# Altium schematic sheet IO.SchDoc: Digital I/O + ESD
size A4; Date: 23.10.2016; Engineer: Matjaz Tome; DocumentNumber: 8; Revision: B1; SheetNumber: 8; SheetTotal: 8; Project: USB DAQ
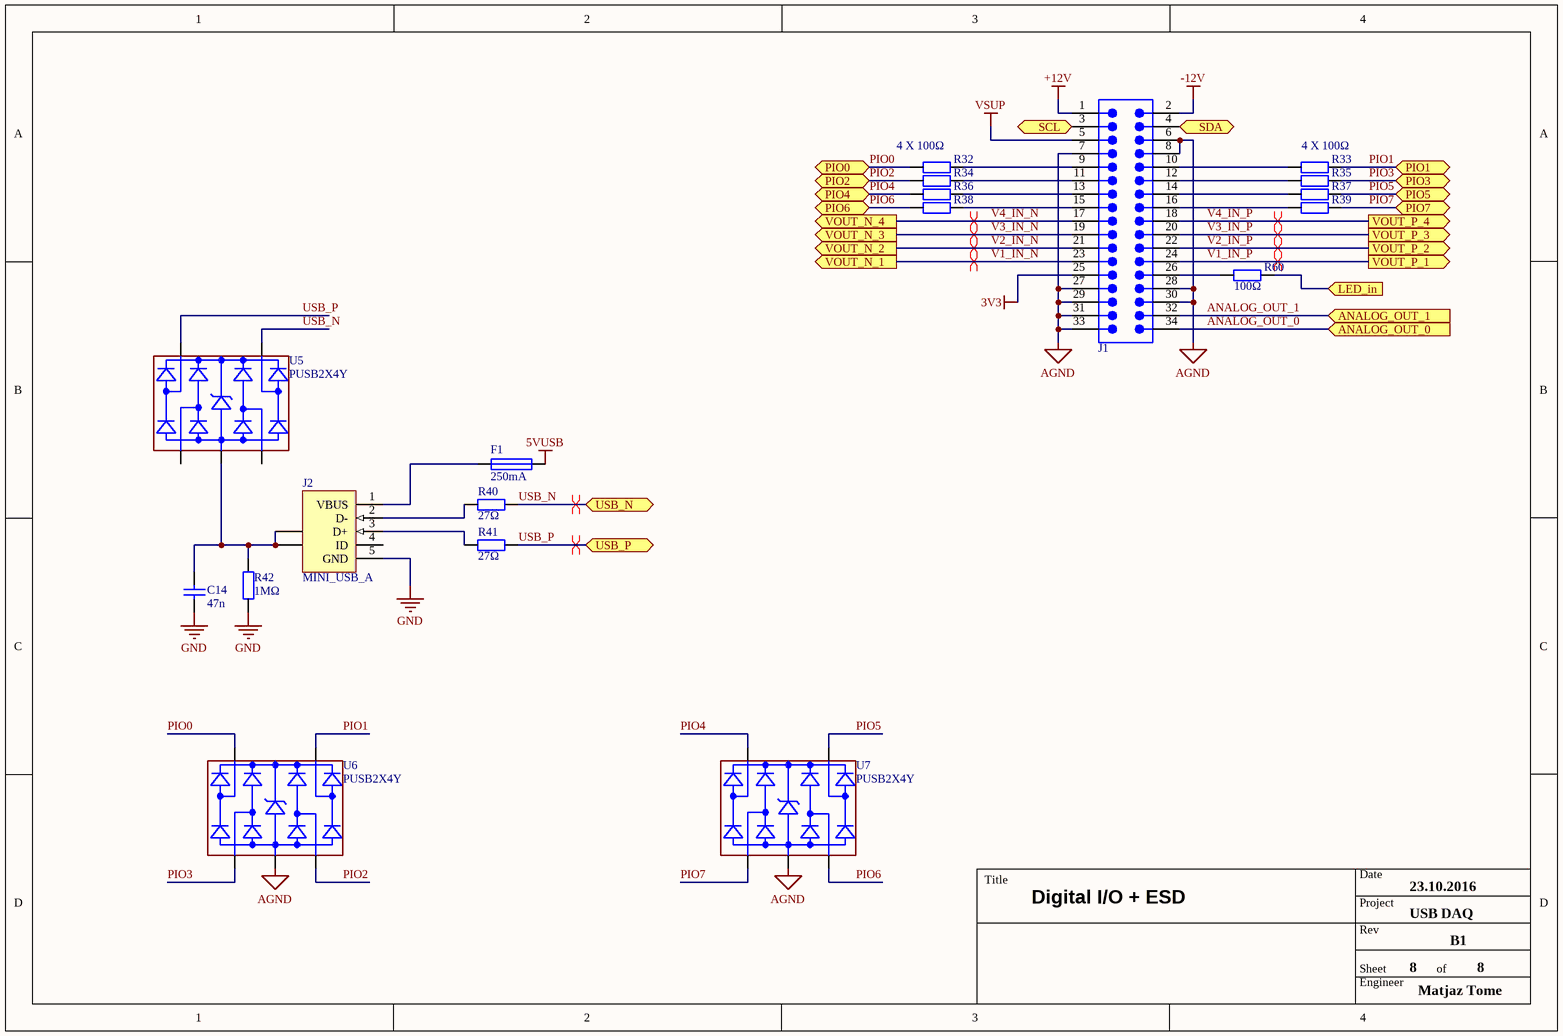
[diagram p0: IO.SchDoc]

## Parts
C14  47n  [0603C]
F1  250mA  [1206]
J1  IDC34R  [IDC34R]  (value not drawn)
J2  MINI_USB_A  [MICRO_USB_A]
R32  100Ω  [0603R]  (value not drawn)
R33  100Ω  [0603R]  (value not drawn)
R34  100Ω  [0603R]  (value not drawn)
R35  100Ω  [0603R]  (value not drawn)
R36  100Ω  [0603R]  (value not drawn)
R37  100Ω  [0603R]  (value not drawn)
R38  100Ω  [0603R]  (value not drawn)
R39  100Ω  [0603R]  (value not drawn)
R40  27Ω  [0603R]
R41  27Ω  [0603R]
R42  1MΩ  [0603R]
R60  100Ω  [0603R]
U5  PUSB2X4Y  [SOT363]
U6  PUSB2X4Y  [SOT363]
U7  PUSB2X4Y  [SOT363]

## Ports
ANALOG_OUT_0 (in), ANALOG_OUT_1 (in), LED_in (in), PIO0 (bidir), PIO1 (bidir), PIO2 (bidir), PIO3 (bidir), PIO4 (bidir), PIO5 (bidir), PIO6 (bidir), PIO7 (bidir), SCL (in), SDA (bidir), USB_N (bidir), USB_P (bidir), VOUT_N_1 (out), VOUT_N_2 (out), VOUT_N_3 (out), VOUT_N_4 (out), VOUT_P_1 (out), VOUT_P_2 (out), VOUT_P_3 (out), VOUT_P_4 (out)

## Nets
3V3: J1.25
5VUSB: F1.2
+12V: J1.1
-12V: J1.2
AGND: J1.6 J1.7 J1.8 J1.27 J1.28 J1.29 J1.30 J1.31 J1.33 U6.2 U7.2
GND: C14.1 J2.5(GND) R42.1
VSUP: J1.5
ANALOG_OUT_0: J1.34 ; port ANALOG_OUT_0
ANALOG_OUT_1: J1.32 ; port ANALOG_OUT_1
LED_in: R60.2 ; port LED_in
PIO0: R32.1 U6.6 ; port PIO0
PIO1: R33.2 U6.4 ; port PIO1
PIO2: R34.1 U6.3 ; port PIO2
PIO3: R35.2 U6.1 ; port PIO3
PIO4: R36.1 U7.6 ; port PIO4
PIO5: R37.2 U7.4 ; port PIO5
PIO6: R38.1 U7.3 ; port PIO6
PIO7: R39.2 U7.1 ; port PIO7
SCL: J1.3 ; port SCL
SDA: J1.4 ; port SDA
USB_N: R40.2 U5.4 ; port USB_N
USB_P: R41.2 U5.6 ; port USB_P
V1_IN_N: J1.23 ; port VOUT_N_1
V1_IN_P: J1.24 ; port VOUT_P_1
V2_IN_N: J1.21 ; port VOUT_N_2
V2_IN_P: J1.22 ; port VOUT_P_2
V3_IN_N: J1.19 ; port VOUT_N_3
V3_IN_P: J1.20 ; port VOUT_P_3
V4_IN_N: J1.17 ; port VOUT_N_4
V4_IN_P: J1.18 ; port VOUT_P_4
NetC14_2: C14.2 J2.6(SHLD) J2.7(SHLD) R42.2 U5.2
NetF1_1: F1.1 J2.1(VBUS)
NetJ1_9: J1.9 R32.2
NetJ1_10: J1.10 R33.1
NetJ1_11: J1.11 R34.2
NetJ1_12: J1.12 R35.1
NetJ1_13: J1.13 R36.2
NetJ1_14: J1.14 R37.1
NetJ1_15: J1.15 R38.2
NetJ1_16: J1.16 R39.1
NetJ1_26: J1.26 R60.1
NetJ2_2: J2.2(D-) R40.1
NetJ2_3: J2.3(D+) R41.1

Not connected (* = marked no-connect by the designer): J2 4(ID); U5 1 3

## Layout directives
differential pair: USB_N, USB_P, V1_IN_N, V1_IN_P, V2_IN_N, V2_IN_P, V3_IN_N, V3_IN_P, V4_IN_N, V4_IN_P

## Notes on the sheet
- (near R32) 4 X 100Ω
- (near R33) 4 X 100Ω
- Title
- Date
- Project
- Rev
- Engineer
- Sheet
- of

## Library data of the parts
C14 = RSC0007: ceramic X7R SMD capacitor smd 0603 47nF 16V; Manufacturer: Multicomp; Manufacturer Number: MC0603B473K160CT; Dealer number: 1759011; Dealer: Farnell; Tolerance: 10%; Part Number: RSC0007; Category: capacitors; Price: 0.009; Value: 47nF; Voltage: 16V; Case: 0603; Technology: SMT; Dielectric: X7R; HelpURL: U:\datasheet\cap\MULTICOMP_2.pdf; Supplier 1: Farnell; Supplier Part Number 1: 1759011
F1 = XXF0001: Polyfuse 250 mA holding current, 500 mA trip current; Manufacturer: Littelfuse; Manufacturer Number: 1206L025YR / 2920L030DR; Dealer number: 1596990; Dealer: Farnell; Trip current: 500mA; Max voltage: 16V; Resistance: 2.3Ω; Part Number: XXF0001; Category: Fuses; Price: 0.46; Type: Poly fuse; Holing current: 250mA; Technology: SMT; HelpURL: U:\datasheet\fuses\litefuse1.pdf; Supplier 1: Farnell; Supplier part number 1: 1596990
J1 = CHI0002: Harting IDC connector 2X17; Manufacturer Number: 09 18 534 7323; Pitch: 2.54mm; Lenght: 2.9mm; Strain Reliefe: no; Part Number: CHI0002; Category: Connectors; Price: 2.26; Manufacturer: Harting; Pins: 34; Orientation: right angle; Technology: THT; Supplier part number 1: 1106736; Supplier 1: Farnell
J2 = XCU0003: CONNECTOR, MICRO USB B, SMD, 5WAY; Manufacturer: FCI; Manufacturer Number: 10104111-0001LF; Gender: Receptacle; Part Number: XCU0003; Category: Connectors; Price: 0.37; Type: A; Size: micro; Technology: SMT / SMT; HelpURL: U:\datasheet\usb_con\FCI2_micro.pdf; Supplier part number 1: 2293755; Supplier 1: Farnell
R32-R39 R60 = XRS0016: resistor smd 0603 100Ω 5% 0.1w; Manufacturer: Multicomp; Manufacturer Number: MCMR06X101 JTL; Temperature coefficient: 100ppm; Part Number: XRS0016; Category: resistors; Price: 0.009€; Value: 100Ω; Power: 0.1W; Tolerance: 5%; Case: 0603; Technology: SMT; Material: Metal film / Metal film; HelpURL: U:\datasheet\res\MULTICOMP 0603.pdf; Supplier part number 1: 2073352; Supplier 1: Farnell
R40 R41 = XRS0033: resistor smd 0603 27Ω 5% 0.1w; Manufacturer: Panasonic; Manufacturer Number: ERJ3GEYJ270V; Temperature coefficient: 200ppm; Part Number: XRS0033; Category: resistors; Price: 0.009€; Value: 27Ω; Power: 0.1W; Tolerance: 5%; Case: 0603; Technology: SMT; Material: Metal film - thick / Metal film - thick; HelpURL: U:\datasheet\res\PANASONIC.pdf; Supplier part number 1: 2059559; Supplier 1: Farnell
R42 = XRS0035: resistor smd 0603 1MΩ 5% 0.1w; Manufacturer: Multicomp; Manufacturer Number: MCMR06X105 JTL; Temperature coefficient: 100ppm; Part Number: XRS0035; Category: resistors; Price: 0.009€; Value: 1MΩ; Power: 0.1W; Tolerance: 5%; Case: 0603; Technology: SMT; Material: Metal film / Metal film; HelpURL: U:\datasheet\res\MULTICOMP 0603.pdf; SKU: 1000100000012; Supplier part number 1: 2073358; Supplier 1: Farnell
U5-U7 = XDE0000: ESD protection for high-speed interfaces; Manufacturer: Multicomp; Clamping voltage: 3.8V; Part Number: XDE0000; Category: diode array; Price: 0.174; Manufacturer Number: PUSB2X4Y; Case: SOT363; Technology: SMT; HelpURL: U:\datasheet\diodes_esd\PUSB2X4Y.pdf; Supplier part number 1: 2400968; Supplier 1: Farnell